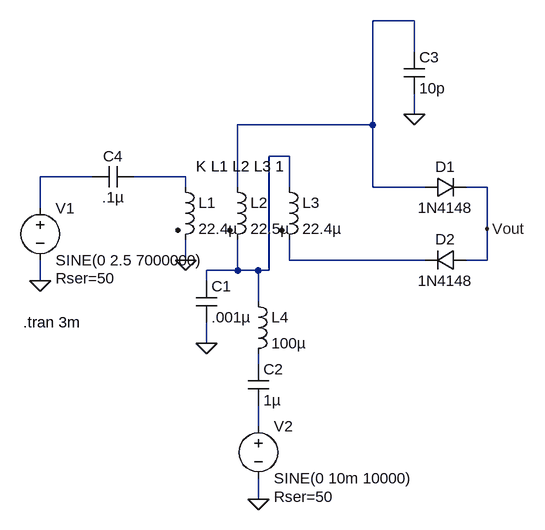
[diagram p0: schematic Modulator.asc]
Modulator.asc, the LTspice schematic file:
Version 4
SHEET 1 880 680
WIRE 464 -128 400 -128
WIRE 464 -80 464 -128
WIRE 464 16 464 -16
WIRE 400 32 400 -128
WIRE 400 32 192 32
WIRE 272 80 240 80
WIRE -32 112 -112 112
WIRE 112 112 32 112
WIRE 112 128 112 112
WIRE 192 128 192 32
WIRE 272 128 272 80
WIRE 400 128 400 32
WIRE 480 128 400 128
WIRE 576 128 544 128
WIRE -112 160 -112 112
WIRE 576 192 576 128
WIRE 112 240 112 208
WIRE 272 240 272 208
WIRE 480 240 272 240
WIRE 576 240 576 192
WIRE 576 240 544 240
WIRE 192 256 192 208
WIRE 192 256 144 256
WIRE 224 256 192 256
WIRE 240 256 240 80
WIRE 240 256 224 256
WIRE -112 272 -112 240
WIRE 144 272 144 256
WIRE 224 304 224 256
WIRE 144 368 144 336
WIRE 224 400 224 384
WIRE 224 496 224 464
WIRE 224 608 224 576
FLAG 112 240 0
FLAG 144 368 0
FLAG -112 272 0
FLAG 224 608 0
FLAG 464 16 0
FLAG 576 192 Vout
SYMBOL ind2 96 112 R0
SYMATTR InstName L1
SYMATTR Value 22.4µ
SYMATTR Type ind
SYMBOL ind2 176 112 R0
SYMATTR InstName L2
SYMATTR Value 22.5µ
SYMATTR Type ind
SYMBOL ind2 256 112 R0
SYMATTR InstName L3
SYMATTR Value 22.4µ
SYMATTR Type ind
SYMBOL cap 128 272 R0
SYMATTR InstName C1
SYMATTR Value .001µ
SYMBOL ind 208 288 R0
SYMATTR InstName L4
SYMATTR Value 100µ
SYMBOL cap 208 400 R0
SYMATTR InstName C2
SYMATTR Value 1µ
SYMBOL voltage -112 144 R0
WINDOW 123 0 0 Left 2
WINDOW 39 24 124 Left 2
SYMATTR SpiceLine Rser=50
SYMATTR InstName V1
SYMATTR Value SINE(0 2.5 7000000)
SYMBOL voltage 224 480 R0
WINDOW 123 0 0 Left 2
WINDOW 39 24 124 Left 2
SYMATTR SpiceLine Rser=50
SYMATTR InstName V2
SYMATTR Value SINE(0 10m 10000)
SYMBOL diode 480 144 R270
WINDOW 0 32 32 VTop 2
WINDOW 3 0 32 VBottom 2
SYMATTR InstName D1
SYMATTR Value 1N4148
SYMBOL diode 544 224 R90
WINDOW 0 0 32 VBottom 2
WINDOW 3 32 32 VTop 2
SYMATTR InstName D2
SYMATTR Value 1N4148
SYMBOL cap 448 -80 R0
SYMATTR InstName C3
SYMATTR Value 10p
SYMBOL cap 32 96 R90
WINDOW 0 0 32 VBottom 2
WINDOW 3 32 32 VTop 2
SYMATTR InstName C4
SYMATTR Value .1µ
TEXT 128 96 Left 2 !K L1 L2 L3 1
TEXT -138 336 Left 2 !.tran 3m

The netlist it stands for:
* Modulator.asc
L1 N004 0 22.4µ
L2 N001 N002 22.5µ
L3 N002 N005 22.4µ
C1 N002 0 .001µ
L4 N002 N006 100µ
C2 N006 N007 1µ
V1 N003 0 SINE(0 2.5 7000000) Rser=50
V2 N007 0 SINE(0 10m 10000) Rser=50
D1 N001 Vout 1N4148
D2 Vout N005 1N4148
C3 N001 0 10p
C4 N004 N003 .1µ
.model D D
.lib standard.dio
K L1 L2 L3 1
.tran 3m
.backanno
.end